# Altium project СlosedLoop_Drive_PCB.PrjPcb
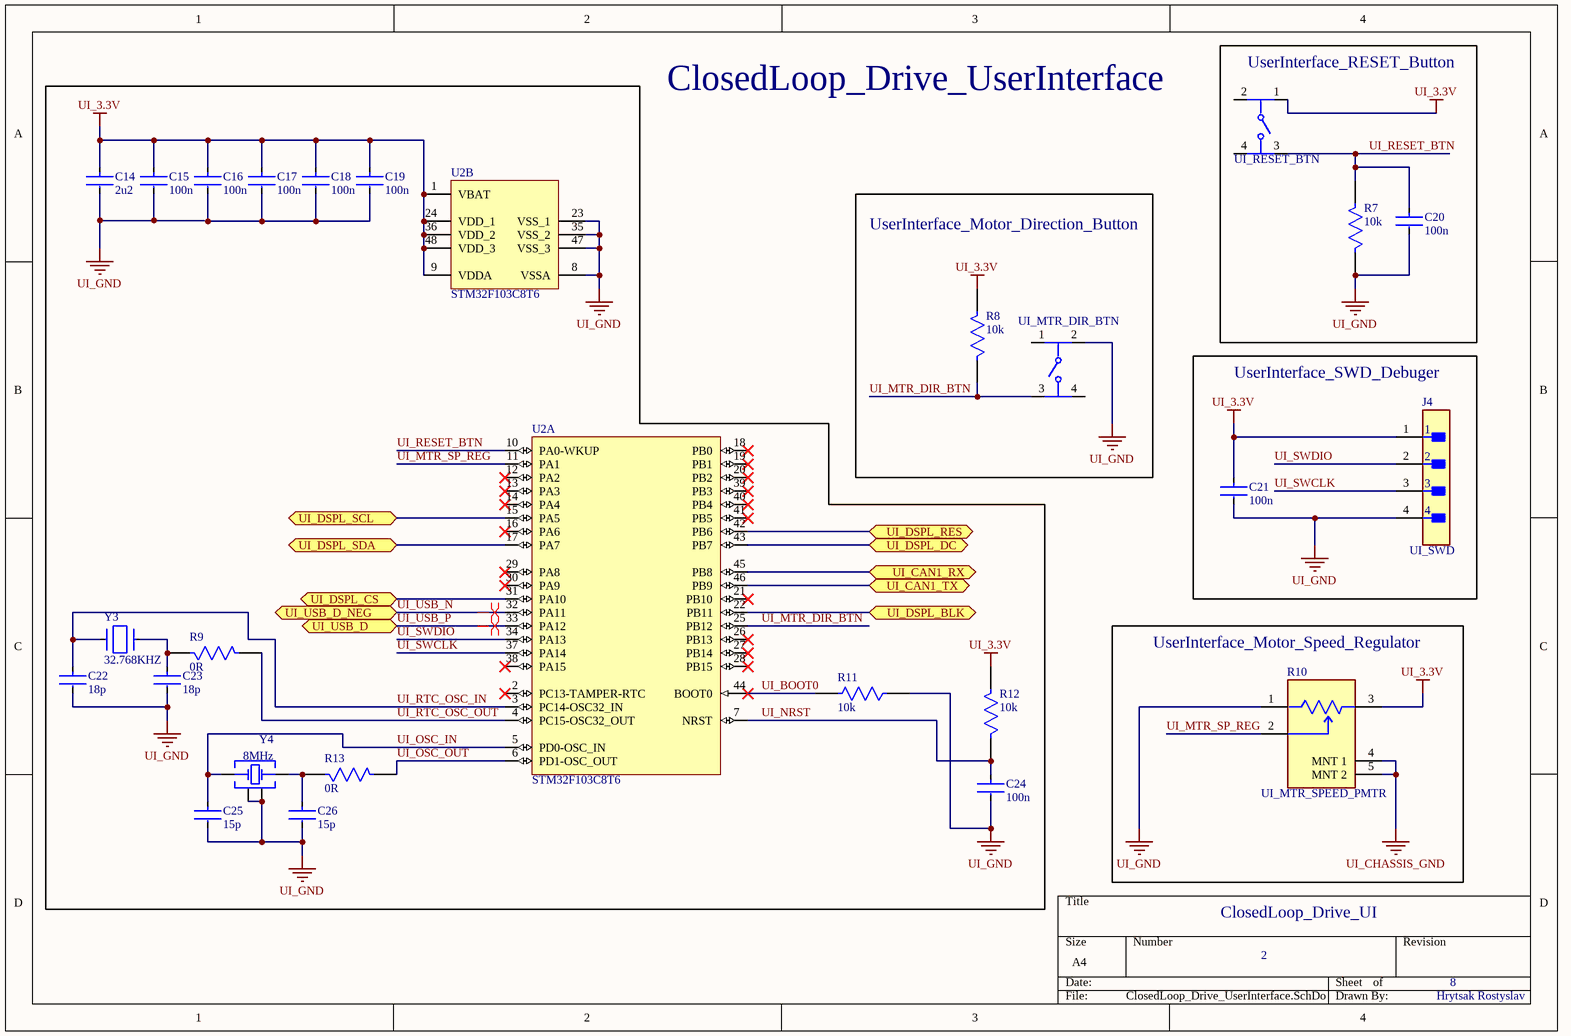
[diagram p0: ClosedLoop_Drive_UserInterface.SchDoc]
7 sheets, 135 parts. Net scope: flat (ports and power ports of the same name join across sheets).
Board file: ClosedLoop_Drive.PcbDoc
Sheets:
  ClosedLoop_Drive_UserInterface.SchDoc
  ClosedLoop_Drive_PowerSupply.SchDoc
  ClosedLoop_Drive_MC_Sensors.SchDoc
  ClosedLoop_Drive_MC_MicroSD_Card.SchDoc
  ClosedLoop_Drive_MC_IBT_2.SchDoc
  ClosedLoop_Drive_CAN_Transceivers.SchDoc
  ClosedLoop_Drive_UI_Display.SchDoc

## Sheet ClosedLoop_Drive_UserInterface.SchDoc
size A4; SheetNumber: 2; SheetTotal: 8

### Parts
C14  2u2  [FP-0805-L_2_01_0_2-W_1_25-MFG]
C15  100n  [FP-0805-L_2_01_0_2-W_1_25-MFG]
C16  100n  [FP-0805-L_2_01_0_2-W_1_25-MFG]
C17  100n  [FP-0805-L_2_01_0_2-W_1_25-MFG]
C18  100n  [FP-0805-L_2_01_0_2-W_1_25-MFG]
C19  100n  [FP-0805-L_2_01_0_2-W_1_25-MFG]
C20  100n  [FP-0805-L_2_01_0_2-W_1_25-MFG]
C21  100n  [FP-0805-L_2_01_0_2-W_1_25-MFG]
C22  18p  [FP-0805-L_2_01_0_2-W_1_25-MFG]
C23  18p  [FP-0805-L_2_01_0_2-W_1_25-MFG]
C24  100n  [FP-0805-L_2_01_0_2-W_1_25-MFG]
C25  15p  [FP-0805-L_2_01_0_2-W_1_25-MFG]
C26  15p  [FP-0805-L_2_01_0_2-W_1_25-MFG]
J4  UI_SWD  [FP-TSW-104-22-G-S-MFG]
R7  10k  [FP-MCU0805-IPC_A]
R8  10k  [FP-MCU0805-IPC_A]
R9  0R  [FP-MCU0805-IPC_A]
R10  UI_MTR_SPEED_PMTR  [FP-PTV09A-4-MFG]
R11  10k  [FP-MCU0805-IPC_A]
R12  10k  [FP-MCU0805-IPC_A]
R13  0R  [FP-MCU0805-IPC_A]
U2  STM32F103C8T6  [STM-LQFP48_L]  (parts A,B of 2)
UI_MTR_DIR_BTN  (no value)  [FP-1-1977223-9-MFG]
UI_RESET_BTN  (no value)  [FP-1-1977223-9-MFG]
Y3  32.768KHZ  [FP-NX2012SA-MFG]
Y4  8MHz  [WE-XTAL_12SMX]

### Blocks framed on the sheet
UserInterface_RESET_Button: C20 R7 UI_RESET_BTN
UserInterface_Motor_Direction_Button: R8 UI_MTR_DIR_BTN
UserInterface_SWD_Debuger: C21 J4
UserInterface_Motor_Speed_Regulator: R10

### Ports
UI_CAN1_RX (bidir, see ClosedLoop_Drive_CAN_Transceivers[1D]), UI_CAN1_TX (bidir, see ClosedLoop_Drive_CAN_Transceivers[1D]), UI_DSPL_BLK (bidir, see ClosedLoop_Drive_UI_Display[3B]), UI_DSPL_CS (bidir, see ClosedLoop_Drive_UI_Display[3C]), UI_DSPL_DC (bidir, see ClosedLoop_Drive_UI_Display[3B]), UI_DSPL_RES (bidir, see ClosedLoop_Drive_UI_Display[3B]), UI_DSPL_SCL (bidir, see ClosedLoop_Drive_UI_Display[3B]), UI_DSPL_SDA (bidir, see ClosedLoop_Drive_UI_Display[3B]), UI_USB_D (bidir, see ClosedLoop_Drive_PowerSupply[3B]), UI_USB_D_NEG (bidir, see ClosedLoop_Drive_PowerSupply[2B])

### Nets
UI_3.3V: C14.1 C15.1 C16.1 C17.1 C18.1 C19.1 C21.1 J4.1 R8.2 R10.3 R12.2 U2.1(VBAT) U2.9(VDDA) U2.24(VDD_1) U2.36(VDD_2) U2.48(VDD_3) UI_RESET_BTN.1
UI_CHASSIS_GND: R10.4(MNT_1) R10.5(MNT_2)
UI_GND: C14.2 C15.2 C16.2 C17.2 C18.2 C19.2 C20.2 C21.2 C22.2 C23.2 C24.2 C25.2 C26.2 J4.4 R7.1 R10.1 R11.1 U2.8(VSSA) U2.23(VSS_1) U2.35(VSS_2) U2.47(VSS_3) UI_MTR_DIR_BTN.2 Y4.2(GND) Y4.4(GND)
UI_BOOT0: R11.2 U2.44(BOOT0)
UI_MTR_DIR_BTN: R8.1 U2.25(PB12) UI_MTR_DIR_BTN.3
UI_MTR_SP_REG: R10.2 U2.11(PA1)
UI_NRST: C24.1 R12.1 U2.7(NRST)
UI_OSC_IN: C25.1 U2.5(PD0-OSC_IN) Y4.3(Crystal)
UI_OSC_OUT: R13.2 U2.6(PD1-OSC_OUT)
UI_RESET_BTN: C20.1 R7.2 U2.10(PA0-WKUP) UI_RESET_BTN.3
UI_RTC_OSC_IN: C22.1 U2.3(PC14-OSC32_IN) Y3.2
UI_RTC_OSC_OUT: R9.2 U2.4(PC15-OSC32_OUT)
UI_SWCLK: J4.3 U2.37(PA14)
UI_SWDIO: J4.2 U2.34(PA13)
UI_USB_N: U2.32(PA11) ; port UI_USB_D_NEG
UI_USB_P: U2.33(PA12) ; port UI_USB_D
NetC23_1: C23.1 R9.1 Y3.1
NetC26_1: C26.1 R13.1 Y4.1(Crystal)
NetJ12_6: U2.42(PB6) ; port UI_DSPL_RES
NetJ12_7: U2.43(PB7) ; port UI_DSPL_DC
NetJ12_8: U2.17(PA7) ; port UI_DSPL_SDA
NetJ12_9: U2.15(PA5) ; port UI_DSPL_SCL
NetJ12_12: U2.31(PA10) ; port UI_DSPL_CS
NetR54_1: U2.22(PB11) ; port UI_DSPL_BLK
NetU2_45: U2.45(PB8) ; port UI_CAN1_RX
NetU2_46: U2.46(PB9) ; port UI_CAN1_TX

Not connected (* = marked no-connect by the designer): U2 2(PC13-TAMPER-RTC)* 12(PA2)* 13(PA3)* 14(PA4)* 16(PA6)* 18(PB0)* 19(PB1)* 20(PB2)* 21(PB10)* 26(PB13)* 27(PB14)* 28(PB15)* 29(PA8)* 30(PA9)* 38(PA15)* 39(PB3)* 40(PB4)* 41(PB5)*; UI_MTR_DIR_BTN 1 4; UI_RESET_BTN 2 4

### Layout directives
differential pair: UI_USB_N, UI_USB_P

### Notes on the sheet
- (near UI_RESET_BTN) ClosedLoop_Drive_UserInterface
- ClosedLoop_Drive_UI
- 2
- 8
- Hrytsak Rostyslav

### Library data of the parts
C14-C26 = CMP-07738-122049624-1: 0805; Tolerance: 10%; Dielectric: X7R; Material: Ceramic; Voltage Rating (DC): 100V; Capacitance: 1µF; Case/Package: 0805; Height: 1.4mm; Voltage Rating: 100V; Schedule B: 8532240020; NexarPartId: 122049624; RoHS: Compliant; Lifecycle Status: Production; Min Operating Temperature: -55°C; Max Operating Temperature: 125°C
J4 = CMP-02766-001236-1: CONN HEADER VERT 4POS 2.54MM; Number of Contacts: 4; Gender: Male; Termination: Solder; Pitch: 2.54mm; Mount: Through Hole; Number of Rows: 1; Packaging: Bulk; Contact Material: Bronze; Contact Plating: Gold; REACH SVHC: No SVHC; Radiation Hardening: No
R7-R9 R11-R13 = CMP-02407-001153-1: 0805; Power Rating: 200mW; Temperature Coefficient: 25ppm/°C; Voltage Rating: 150V; Resistance: 4.99kR; Tolerance: 0.5%; Case Code (Imperial): 0805; Features: Automotive AEC-Q200; Case Code (Metric): 2012; Weight: 0.000162oz; Width: 0.049inch; Packaging: Tape and Reel; Composition: Thin Film; Height: 0.024inch; Termination: SMD/SMT; Number of Terminations: 2; Min Operating Temperature: -55°C; Length: 0.079inch; Package Quantity: 5000; Max Operating Temperature: 175°C; Case/Package: 0805; Max Power Dissipation: 200mW
R10 = CMP-07234-000052-1: POT 10K OHM 1/20W CARBON LINEAR; Power Rating: 50mW; Number of Gangs: 1; Hole Diameter: 9.1mm; Actuator Diameter: 0.236inch; Resistance Tolerance: 20%; Resistance: 10kR; Actuator Length: 0.984inch; Min Operating Temperature: -10°C; RoHS Compliant: Yes; Technology: CARBON FILM; Radiation Hardening: No; Taper: Linear; Military Standard: Not; Type: Potentiometer; Mount: Through Hole; Length: 11.4mm; Tolerance: 20%; Max Power Dissipation: 50mW; Max Operating Temperature: 50°C; Package Quantity: 100; Termination: PCB; Packaging: Bulk; Depth: 12.5mm; Resistor Type: Carbon; Number of Turns: 1; Series: Pro Audio PTV09; Height: 12.5mm; REACH SVHC: No SVHC
U2 = CMP-0237-00215-3: ARM Cortex-M3 32-bit MCU, 64 KB Flash, 20 KB Internal RAM, 37 I/Os, 48-pin LQFP, -40 to 85 degC, Tray; Supply Voltage(Vcc) min (V): 2; Internal RAM Size (kB): 20; FLASH Size (Prog) (kB): 64; A/D Converter: 2x12-bit (10 Channel); I/Os (High Current): 37; Operating Frequency(F) (Processor speed) (MHz): 72; Core: ARM Cortex-M3; ComponentLink3Description: Package Specification; Mounting Technology: Surface Mount; PartNumber: STM32F103C8T6; PackageReference: LQFP48; Packing: Tray; ComponentLink3URL: http://www.st.com/st-web-ui/static/active/en/resource/technical/document/datasheet/DM00058181.pdf; DatasheetVersion: Rev. 16; ComponentLink1URL: http://www.st.com/web/en/home.html; PackageVersion: Rev. 6, 06/2013; ComponentLink2URL: http://www.st.com/st-web-ui/static/active/en/resource/technical/document/datasheet/CD00161566.pdf; ComponentLink1Description: Manufacturer URL; ComponentLink2Description: Datasheet; PackageDescription: 48-Pin Low Profile Quad Flat Package, 7 x 7 mm Body, 0.5 mm Pitch
UI_MTR_DIR_BTN UI_RESET_BTN = CMP-03407-000015-1: SWITCH TACTILE SPST-NO 0.05A 24V; Current Rating: 50mA; Operating Force: 2.55N; Throw Configuration: SPST; Actuator Material: Nylon; Actuator Color: Pink; Mechanical Life: 1000000Cycles; Illumination Type: Non-Illuminated; Switch Travel: 0.25mm; Switch Function: Off-Mom; Actuator Type: Standard; RoHS Compliant: Yes; Min Operating Temperature: -40°C; Contact Plating: Silver; Max Operating Temperature: 105°C; Contact Material: Stainless Steel; Max Current Rating: 50mA; Series: FSMJSMA; Length: 6mm; Radiation Hardening: No; Depth: 10mm; Max Voltage Rating (DC): 24V; Orientation: Straight; Termination: Gull Wing; Voltage Rating (DC): 24V; Packaging: Bulk; Mount: Surface Mount; Case/Package: SMD/SMT; Package Quantity: 750
Y3 = CMP-200220-000019-1: CRYSTAL 32.7680KHZ 12.5PF SMD; Frequency Tolerance: 20ppm; ESR (Equivalent Series Resistance): 80kR; Mount: Surface Mount; Packaging: Cut Tape; Min Operating Temperature: -40°C; Max Operating Temperature: 85°C; Case/Package: SMD/SMT; Frequency: 32.768kHz; RoHS Compliant: Yes; Length: 0.081inch; Series: NX2012SA; Height: 0.024inch; Width: 0.047inch; Load Capacitance: 12.5pF
Y4 = CMP-03913-116855696-2: WE-XTAL Quartz Crystal; Frequency: 8MHz; Max Operating Temperature: 70°C; Height: 1.4mm; Min Operating Temperature: -20°C; Length: 7mm; Width: 5mm

## Sheet ClosedLoop_Drive_PowerSupply.SchDoc
size A4; SheetNumber: 3; SheetTotal: 8
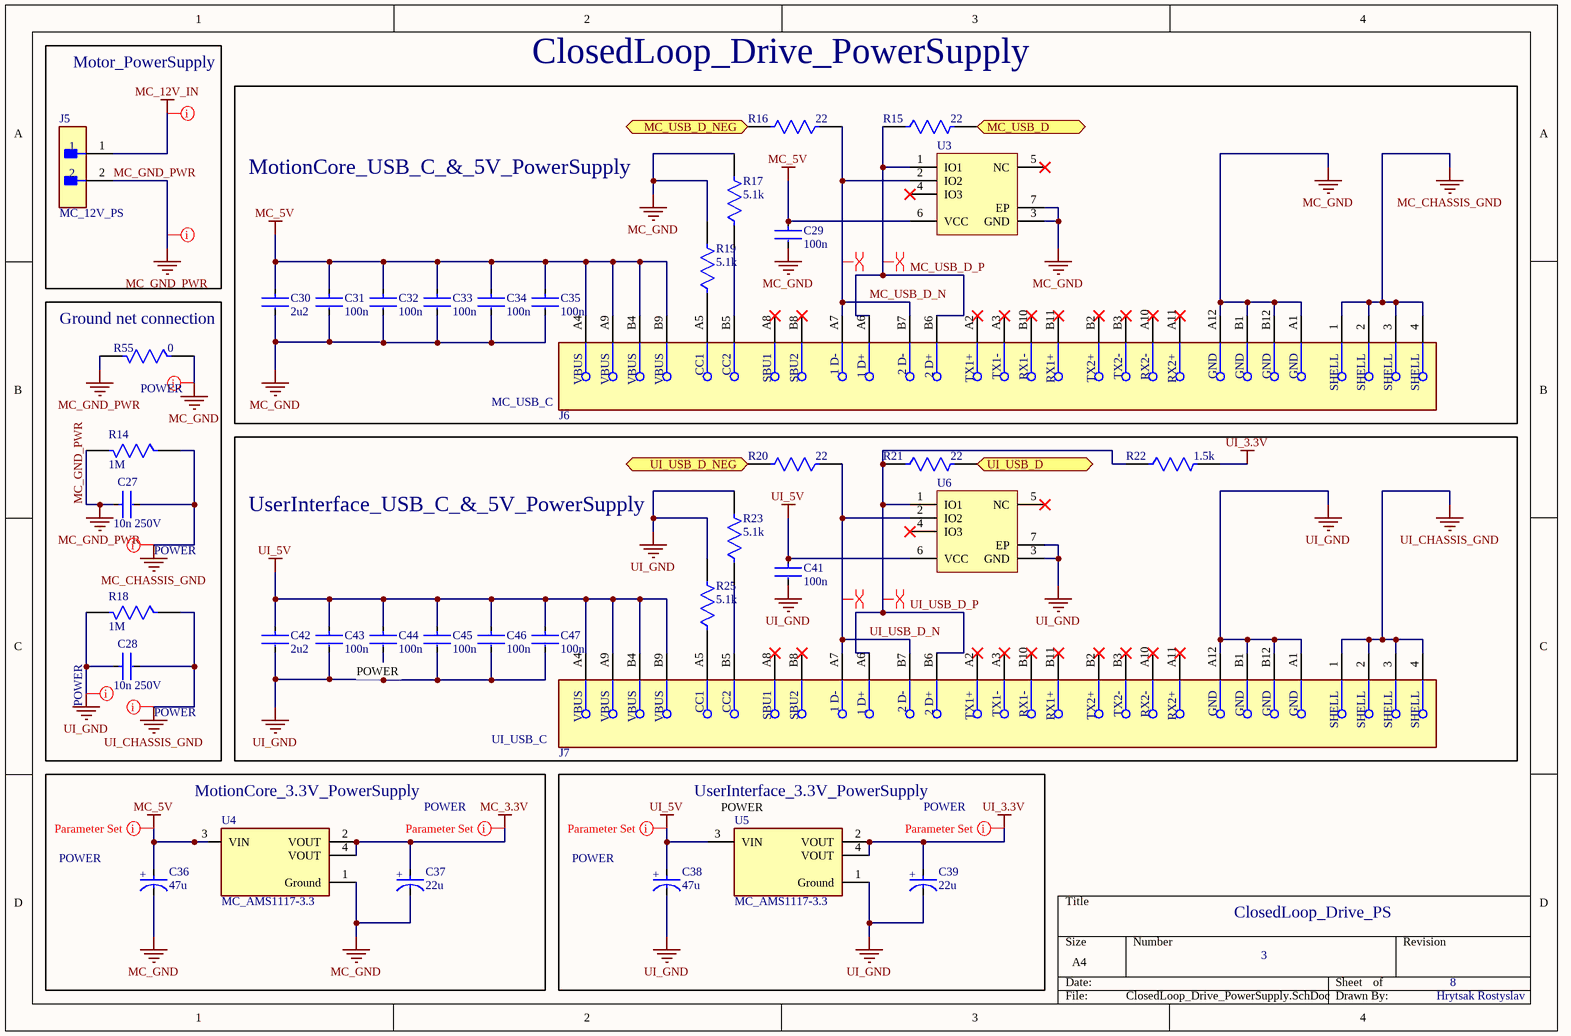
[diagram p1: ClosedLoop_Drive_PowerSupply.SchDoc]

### Parts
C27  10n 250V  [FP-0805-L_2_01_0_2-W_1_25-MFG]
C28  10n 250V  [FP-0805-L_2_01_0_2-W_1_25-MFG]
C29  100n  [FP-0805-L_2_01_0_2-W_1_25-MFG]
C30  2u2  [FP-0805-L_2_01_0_2-W_1_25-MFG]
C31  100n  [FP-0805-L_2_01_0_2-W_1_25-MFG]
C32  100n  [FP-0805-L_2_01_0_2-W_1_25-MFG]
C33  100n  [FP-0805-L_2_01_0_2-W_1_25-MFG]
C34  100n  [FP-0805-L_2_01_0_2-W_1_25-MFG]
C35  100n  [FP-0805-L_2_01_0_2-W_1_25-MFG]
C36  47u  [FP-RAD-TH-D_6_3_0_5-L_11-MFG]
C37  22u  [FP-RAD-TH-D_6_3_0_5-L_11-MFG]
C38  47u  [FP-RAD-TH-D_6_3_0_5-L_11-MFG]
C39  22u  [FP-RAD-TH-D_6_3_0_5-L_11-MFG]
C41  100n  [FP-0805-L_2_01_0_2-W_1_25-MFG]
C42  2u2  [FP-0805-L_2_01_0_2-W_1_25-MFG]
C43  100n  [FP-0805-L_2_01_0_2-W_1_25-MFG]
C44  100n  [FP-0805-L_2_01_0_2-W_1_25-MFG]
C45  100n  [FP-0805-L_2_01_0_2-W_1_25-MFG]
C46  100n  [FP-0805-L_2_01_0_2-W_1_25-MFG]
C47  100n  [FP-0805-L_2_01_0_2-W_1_25-MFG]
J5  MC_12V_PS  [FP-TSW-102-07-F-S-MFG]
J6  MC_USB_C  [FP-12401832E402A-MFG]
J7  UI_USB_C  [FP-12401832E402A-MFG]
R14  1M  [FP-MCU0805-IPC_A]
R15  22  [FP-MCU0805-IPC_A]
R16  22  [FP-MCU0805-IPC_A]
R17  5.1k  [FP-MCU0805-IPC_A]
R18  1M  [FP-MCU0805-IPC_A]
R19  5.1k  [FP-MCU0805-IPC_A]
R20  22  [FP-MCU0805-IPC_A]
R21  22  [FP-MCU0805-IPC_A]
R22  1.5k  [FP-MCU0805-IPC_A]
R23  5.1k  [FP-MCU0805-IPC_A]
R25  5.1k  [FP-MCU0805-IPC_A]
R55  0  [FP-MCU0805-IPC_A]
U3  (no value)  [DRS0006A_V]
U4  MC_AMS1117-3.3  [FP-AMS1117-IPC_C]
U5  MC_AMS1117-3.3  [FP-AMS1117-IPC_C]
U6  (no value)  [DRS0006A_V]

### Blocks framed on the sheet
Motor_PowerSupply: J5
ClosedLoop_Drive_PowerSupply: C29-C35 J6 R15-R17 R19 U3
Ground net connection: C27 C28 R14 R18 R55
UserInterface_USB_C_&_5V_PowerSupply: C41-C47 J7 R20-R23 R25 U6
MotionCore_3.3V_PowerSupply: C36 C37 U4
UserInterface_3.3V_PowerSupply: C38 C39 U5

### Ports
MC_USB_D (bidir, see ClosedLoop_Drive_MotionCore[1C]), MC_USB_D_NEG (bidir, see ClosedLoop_Drive_MotionCore[1C]), UI_USB_D (bidir, see ClosedLoop_Drive_UserInterface[1C]), UI_USB_D_NEG (bidir, see ClosedLoop_Drive_UserInterface[1C])

### Nets
MC_3.3V: C37.2(A) U4.2(VOUT) U4.4(VOUT)
MC_5V: C29.1 C30.1 C31.1 C32.1 C33.1 C34.1 C35.1 C36.2(A) J6.A4(VBUS) J6.A9(VBUS) J6.B4(VBUS) J6.B9(VBUS) U3.6(VCC) U4.3(VIN)
MC_12V_IN: J5.1
MC_CHASSIS_GND: C27.2 J6.1(SHELL) J6.2(SHELL) J6.3(SHELL) J6.4(SHELL) R14.1
MC_GND: C29.2 C30.2 C31.2 C32.2 C33.2 C34.2 C35.2 C36.1(C) C37.1(C) J6.A1(GND) J6.A12(GND) J6.B1(GND) J6.B12(GND) R17.2 R19.2 R55.1 U3.3(GND) U3.7(EP) U4.1(Ground)
MC_GND_PWR: C27.1 J5.2 R14.2 R55.2
UI_3.3V: C39.2(A) R22.2 U5.2(VOUT) U5.4(VOUT)
UI_5V: C38.2(A) C41.1 C42.1 C43.1 C44.1 C45.1 C46.1 C47.1 J7.A4(VBUS) J7.A9(VBUS) J7.B4(VBUS) J7.B9(VBUS) U5.3(VIN) U6.6(VCC)
UI_CHASSIS_GND: C28.2 J7.1(SHELL) J7.2(SHELL) J7.3(SHELL) J7.4(SHELL) R18.1
UI_GND: C28.1 C38.1(C) C39.1(C) C41.2 C42.2 C43.2 C44.2 C45.2 C46.2 C47.2 J7.A1(GND) J7.A12(GND) J7.B1(GND) J7.B12(GND) R18.2 R23.2 R25.2 U5.1(Ground) U6.3(GND) U6.7(EP)
MC_USB_D_N: J6.A7(1_D-) J6.B7(2_D-) R16.1 U3.2(IO2)
MC_USB_D_P: J6.A6(1_D+) J6.B6(2_D+) R15.1 U3.1(IO1)
UI_USB_D_N: J7.A7(1_D-) J7.B7(2_D-) R20.1 U6.2(IO2)
UI_USB_D_P: J7.A6(1_D+) J7.B6(2_D+) R21.1 R22.1 U6.1(IO1)
UI_USB_N: R20.2 ; port UI_USB_D_NEG
UI_USB_P: R21.2 ; port UI_USB_D
NetJ6_A5: J6.A5(CC1) R19.1
NetJ6_B5: J6.B5(CC2) R17.1
NetJ7_A5: J7.A5(CC1) R25.1
NetJ7_B5: J7.B5(CC2) R23.1
NetR15_2: R15.2 ; port MC_USB_D
NetR16_2: R16.2 ; port MC_USB_D_NEG

Not connected (* = marked no-connect by the designer): J6 A2(TX1+)* A3(TX1-)* A8(SBU1)* A10(RX2-)* A11(RX2+)* B2(TX2+)* B3(TX2-)* B8(SBU2)* B10(RX1-)* B11(RX1+)*; J7 A2(TX1+)* A3(TX1-)* A8(SBU1)* A10(RX2-)* A11(RX2+)* B2(TX2+)* B3(TX2-)* B8(SBU2)* B10(RX1-)* B11(RX1+)*; U3 4(IO3)* 5(NC)*; U6 4(IO3)* 5(NC)*

### Layout directives
CompClassName: POWER; net class POWER: MC_3.3V, MC_5V, UI_3.3V, UI_5V
differential pair: MC_USB_D_N, MC_USB_D_P, UI_USB_D_N, UI_USB_D_P
rule Supply Nets [Voltage = 0.000]; net class POWER: MC_12V_IN, MC_GND_PWR
CompClassName: POWER; rule Supply Nets [Voltage = 0.000]; net class POWER: MC_CHASSIS_GND, MC_GND, UI_CHASSIS_GND, UI_GND

### Notes on the sheet
- MotionCore_USB_C_&_5V_PowerSupply
- (near C44) POWER
- (near U5) POWER
- ClosedLoop_Drive_PS
- 3
- 8
- Hrytsak Rostyslav
- (in symbol CMP-05427-000141-1) +

### Library data of the parts
C27-C35 C41-C47 = CMP-07738-122049624-1: as C14 on sheet ClosedLoop_Drive_UserInterface; Case/Package: 0805; Height: 1.4mm; Voltage Rating: 100V; Schedule B: 8532240020; NexarPartId: 122049624; RoHS: Compliant; Lifecycle Status: Production; Min Operating Temperature: -55°C; Max Operating Temperature: 125°C
C36-C39 = CMP-05427-000141-1: Aluminum Electrolytic Capacitors (Radial Lead Type) AEC-Q200 Qualified 100uF ±20% 25V; Lead Diameter: 0.5mm; Life (Hours): 1000Hour; Ripple Current: 130mA; Lead/Base Style: Straight; Construction: RADIAL; Radiation Hardening: No; Packaging: Ammo Pack; Termination: Radial; Mount: Through Hole; Lead Pitch: 2.5mm; Tolerance: 20%; Height - Seated (Max): 0.48inch; Height: 11.2mm; Max Operating Temperature: 105°C; Length: 11.2mm; Diameter: 6.3mm; RoHS Compliant: Yes; Voltage Rating: 25V; Min Operating Temperature: -55°C; Package Quantity: 2000; Capacitance: 100uF; Width: 6.3mm; Voltage Rating (DC): 25V; Series: NHG; Contact Plating: Tin; Case/Package: Radial
J5 = CMP-02766-001458-1: CONN HEADER VERT 2POS 2.54MM; Gender: Male; Max Current Rating: 7.6A; Number of Contacts: 2; Max Voltage Rating (AC): 550V; Orientation: Straight; Depth: 2.54mm; Series: TSW; Package Quantity: 1; Min Operating Temperature: -55°C; Max Operating Temperature: 125°C; Contact Type: Male Pin; Contact Shape: Square; Color: Black; Housing Color: Black; Connector Type: Header; Fastening Type: Pull; Radiation Hardening: No; Pitch: 2.54mm; Housing Material: Polyester; Mount: Through Hole; Number of Positions: 2; Number of Rows: 1; Contact Material: Bronze; Insulation Color: Black; Contact Finish - Mating: GOLD; Termination: Solder; Insulation Material: PBT; Length: 5.08mm; Flammability Rating: UL94 V-0; Contact Mating Length: 0.23inch; REACH SVHC: No SVHC; Contact Plating: Gold; RoHS Compliant: Yes; Packaging: Bulk
J6 J7 = CMP-02355-000004-1: CONN RCP USB3.1 TYPEC 24P SMD RA
R14-R23 R25 R55 = CMP-02407-001153-1: as R7 on sheet ClosedLoop_Drive_UserInterface; Case Code (Imperial): 0805; Features: Automotive AEC-Q200; Case Code (Metric): 2012; Weight: 0.000162oz; Width: 0.049inch; Packaging: Tape and Reel; Composition: Thin Film; Height: 0.024inch; Termination: SMD/SMT; Number of Terminations: 2; Min Operating Temperature: -55°C; Length: 0.079inch; Package Quantity: 5000; Max Operating Temperature: 175°C; Case/Package: 0805; Max Power Dissipation: 200mW
U3 U6 = CMP-0326-00043-3: Low-Capacitance + / - 15 kV ESD-Protection Array for High-Speed Data Interfaces, 3 Channels, -40 to +85 degC, 6-pin SON (DRS), Green (RoHS & no Sb/Br); Manufacturer: Texas Instruments; PartNumber: TPD3E001DRSR; Breakdown Voltage(Min)(V): 11; USB High Speed: TRUE; IO Capacitance(Typ)(pF): 1.5; IEC 61000-4-2 Air-Gap(+/- kV): 15; IEC 61000-4-2 Contact(+/- kV): 8; IO Leakage Current(nA): 1; SubFamily: ESD Solution; ComponentLink1URL: http://www.ti.com/; PackageVersion: revF, Jul-2011; ComponentLink2Description: Datasheet; PackageDescription: 6-Pin Plastic Small Outline No-Lead, 3 x 3 x 0.8 mm Body, 0.95 mm Pitch; Mounting Technology: Surface Mount; DatasheetVersion: SLLS683D; ComponentLink3URL: SamplesURL:http://www.ti.com/product/tpd3e001#samples; ComponentLink2URL: http://www.ti.com/general/docs/lit/getliterature.tsp?genericPartNumber=TPD3E001&fileType=pdf; ComponentLink1Description: Manufacturer URL; ComponentLink3Description: URL Link1; PackageReference: DRS0006A; Eco-Plan: Green (RoHS & no Sb/Br)
U4 U5 = CMP-209535-000001-1: LDO Voltage Regulators 1A, 3.3V; Manufacturer: Advanced Monolithic Systems; Dropout Voltage: 1.1V; Output Type: Fixed; Nominal Supply Current: 5mA; Max Power Dissipation: 1.2W; Max Supply Voltage: 15V; Number Of Outputs: 1; Standoff Height: 0.64mm; Max Junction Temp: +125°C; Height: 1.8mm; Package: AMS1117; Device Class L2: Power Management ICs; ComponentLink2Description: Datasheet; ComponentLink2URL: http://www.advanced-monolithic.com/pdf/ds1117.pdf; Category: IC; RoHS: TRUE; Automotive: No; Device Class L1: Integrated Circuits (ICs); Output Current: 1A; Device Class L3: Voltage Regulators - Linear; Temperature: -40°C to +125°C; Output Voltage: 3.3V; Manufacturer Part Number: AMS1117-3.3; Temperature Range Low: -40°C; Octopart: https://octopart.com/ams1117-3.3-advanced+monolithic+systems-25899300; Lead Free: Yes; Ipc Land Pattern Name: SOT229P700X180-4; Temperature Range High: +125°C

## Sheet ClosedLoop_Drive_MC_Sensors.SchDoc
size A4; SheetNumber: 4; SheetTotal: 8
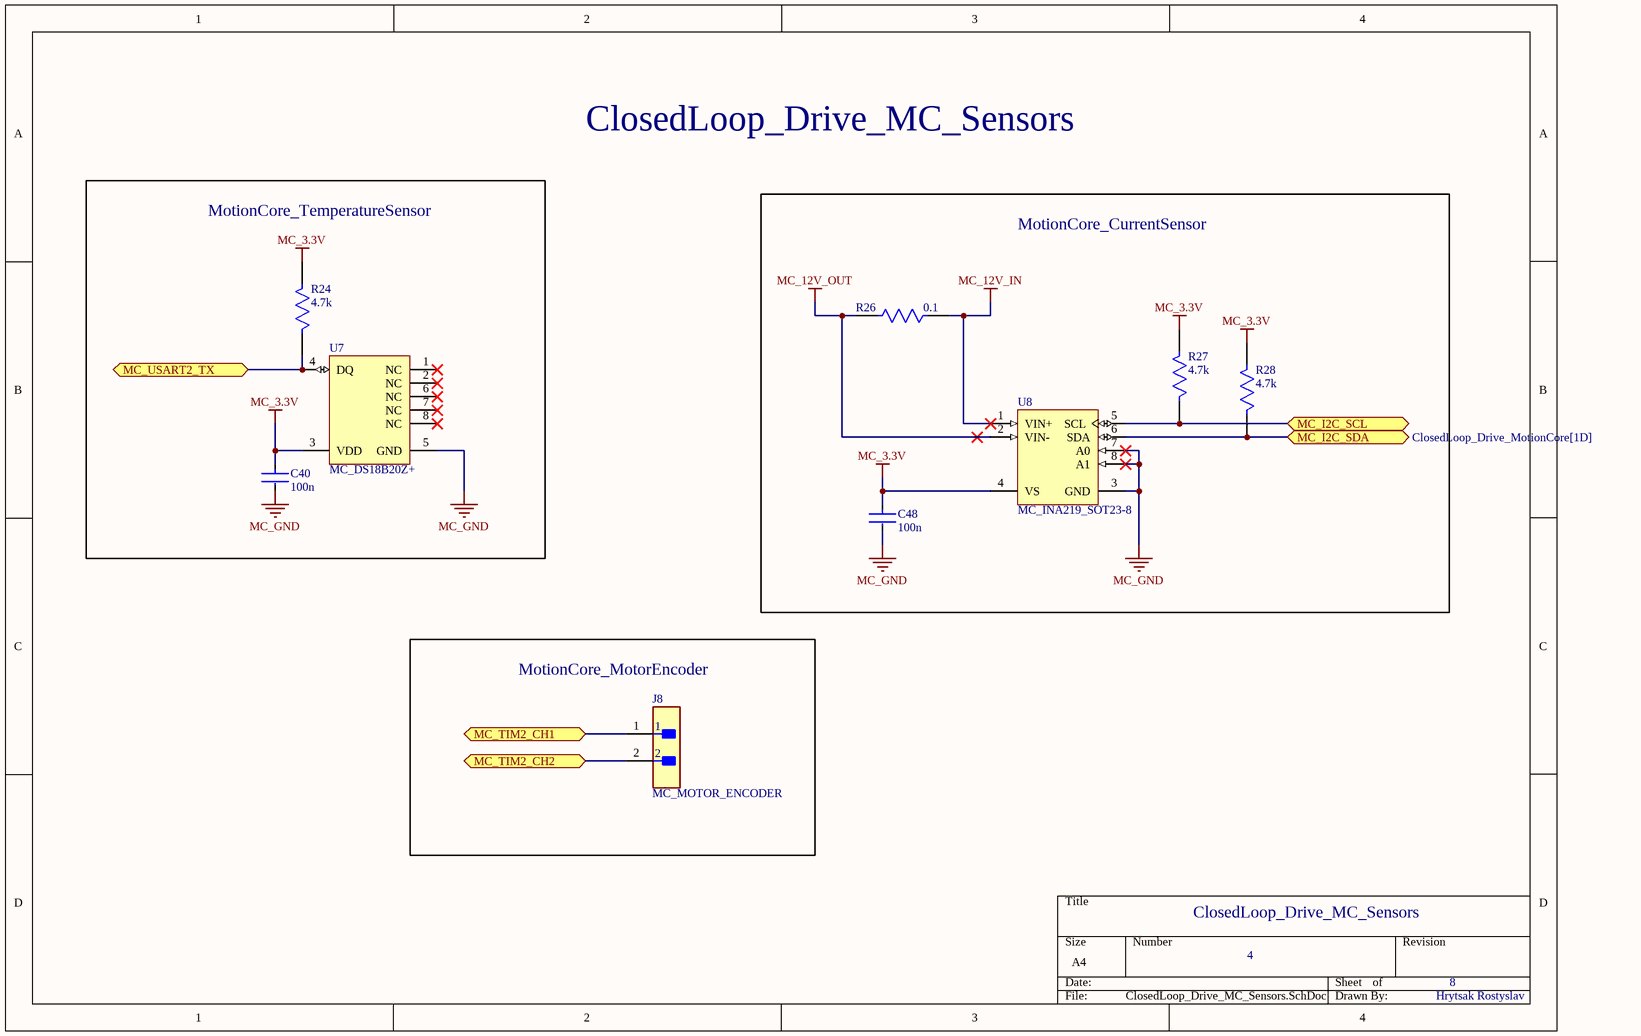
[diagram p2: ClosedLoop_Drive_MC_Sensors.SchDoc]

### Parts
C40  100n  [FP-0805-L_2_01_0_2-W_1_25-MFG]
C48  100n  [FP-0805-L_2_01_0_2-W_1_25-MFG]
J8  MC_MOTOR_ENCODER  [FP-TSW-102-07-F-S-MFG]
R24  4.7k  [FP-MCU0805-IPC_A]
R26  0.1  [FP-CRA2512-IPC_C]
R27  4.7k  [FP-MCU0805-IPC_A]
R28  4.7k  [FP-MCU0805-IPC_A]
U7  MC_DS18B20Z+  [MAXM-S8+2_L]
U8  MC_INA219_SOT23-8  [DCN0008A_L]

### Blocks framed on the sheet
MotionCore_TemperatureSensor: C40 R24 U7
MotionCore_CurrentSensor: C48 R26-R28 U8
MotionCore_MotorEncoder: J8

### Ports
MC_I2C_SCL (bidir, see ClosedLoop_Drive_MotionCore[1D]), MC_I2C_SDA (bidir, see ClosedLoop_Drive_MotionCore[1D]), MC_TIM2_CH1 (bidir, see ClosedLoop_Drive_MotionCore[1C]), MC_TIM2_CH2 (bidir, see ClosedLoop_Drive_MotionCore[1C]), MC_USART2_TX (bidir, see ClosedLoop_Drive_MotionCore[1C])

### Nets
MC_3.3V: C40.1 C48.1 R24.2 R27.2 R28.2 U7.3(VDD) U8.4(VS)
MC_12V_IN: R26.1 U8.1(VIN+)
MC_12V_OUT: R26.2 U8.2(VIN-)
MC_GND: C40.2 C48.2 U7.5(GND) U8.3(GND) U8.7(A0) U8.8(A1)
NetJ8_1: J8.1 ; port MC_TIM2_CH1
NetJ8_2: J8.2 ; port MC_TIM2_CH2
NetR24_1: R24.1 U7.4(DQ) ; port MC_USART2_TX
NetR27_1: R27.1 U8.5(SCL) ; port MC_I2C_SCL
NetR28_1: R28.1 U8.6(SDA) ; port MC_I2C_SDA

Not connected (* = marked no-connect by the designer): U7 1(NC)* 2(NC)* 6(NC)* 7(NC)* 8(NC)*

### Notes on the sheet
- ClosedLoop_Drive_MC_Sensors
- 4
- 8
- Hrytsak Rostyslav

### Library data of the parts
C40 C48 = CMP-07738-122049624-1: as C14 on sheet ClosedLoop_Drive_UserInterface; Case/Package: 0805; Height: 1.4mm; Voltage Rating: 100V; Schedule B: 8532240020; NexarPartId: 122049624; RoHS: Compliant; Lifecycle Status: Production; Min Operating Temperature: -55°C; Max Operating Temperature: 125°C
J8 = CMP-02766-001458-1: as J5 on sheet ClosedLoop_Drive_PowerSupply; Orientation: Straight; Depth: 2.54mm; Series: TSW; Package Quantity: 1; Min Operating Temperature: -55°C; Max Operating Temperature: 125°C; Contact Type: Male Pin; Contact Shape: Square; Color: Black; Housing Color: Black; Connector Type: Header; Fastening Type: Pull; Radiation Hardening: No; Pitch: 2.54mm; Housing Material: Polyester; Mount: Through Hole; Number of Positions: 2; Number of Rows: 1; Contact Material: Bronze; Insulation Color: Black; Contact Finish - Mating: GOLD; Termination: Solder; Insulation Material: PBT; Length: 5.08mm; Flammability Rating: UL94 V-0; Contact Mating Length: 0.23inch; REACH SVHC: No SVHC; Contact Plating: Gold; RoHS Compliant: Yes; Packaging: Bulk
R24 R27 R28 = CMP-02407-001153-1: as R7 on sheet ClosedLoop_Drive_UserInterface; Case Code (Imperial): 0805; Features: Automotive AEC-Q200; Case Code (Metric): 2012; Weight: 0.000162oz; Width: 0.049inch; Packaging: Tape and Reel; Composition: Thin Film; Height: 0.024inch; Termination: SMD/SMT; Number of Terminations: 2; Min Operating Temperature: -55°C; Length: 0.079inch; Package Quantity: 5000; Max Operating Temperature: 175°C; Case/Package: 0805; Max Power Dissipation: 200mW
R26 = CMP-07231-006698-1: RES 0.1 OHM 1% 3W 2512
U7 = CMP-0253-00019-2: High-Precision 1-Wire Digital Thermometer, -55 to 125 degC, 8-Pin SOIC (S8+2), Pb-Free; Sensor Type: Local; Temp. Thresh.: Programmable (NV); Parasite Pwr.: Yes; ComponentLink1Description: Manufacturer URL; PartNumber: DS18B20Z+; Mounting Technology: Surface Mount; ComponentLink2URL: http://datasheets.maximintegrated.com/en/ds/DS18B20.pdf; Code_JEDEC: MS012; ComponentLink2Description: Datasheet; DatasheetVersion: Rev. 4; PackageVersion: Rev. D, 10/2012; ComponentLink1URL: http://www.maximintegrated.com/; PackageReference: S8+2; ComponentLink3URL: http://pdfserv.maximintegrated.com/package_dwgs/21-0041.PDF; Interface: 1-Wire; ComponentLink3Description: Package Specification; RoHS: Pb-Free; Multi Droppable: Yes; Generic Part Number: DS18B20; PackageDescription: 8-Pin Small-Outline IC, Narrow (0.15in) (S8+2), Body 4.90 x 3.90 mm, Pitch 1.27 mm
U8 = CMP-0704-00039-2: Zero-Drift, Bi-Directional Current / Power Monitor, 3 to 5.5 V, -40 to 125 degC, 8-pin SOT23 (DCN8), Green (RoHS & no Sb/Br); Manufacturer: Texas Instruments; PartNumber: INA219AIDCNT; Input Offset (+/-)(Max)(uV): 100; Common Mode Range(Max)(V): 26; Gain(V/V): 1, 0.5, 0.25, 0.125; Vs(Min)(V): 3; Vs(Max)(V): 5.5; Small-Signal Bandwidth(Typ)(MHz): 0.011; Rating: Catalog; SubFamily: Current Shunt Monitor; Common Mode Range(Min)(V): 0; Quiescent Current (+/-)(Typ)(mA): 0.7; Code_JEDEC: MO-178; DatasheetVersion: SBOS448F; ComponentLink3URL: http://www.ti.com/lit/ml/mpds099c/mpds099c.pdf; PackageReference: DCN0008A; Eco-Plan: Green (RoHS & no Sb/Br); PackageVersion: 4202106/D, 11/2009; PackageDescription: 8-Pin Plastic Small Outline, Body 1.6 x 2.9 mm, Pitch 0.65 mm; ComponentLink3Description: Package Specification; ComponentLink1Description: Manufacturer URL; ComponentLink1URL: http://www.ti.com/; CMRR(Min)(dB): 100; Mounting Technology: Surface Mount; ComponentLink2URL: http://www.ti.com/general/docs/lit/getliterature.tsp?genericPartNumber=INA219&fileType=pdf; ComponentLink2Description: Datasheet

## Sheet ClosedLoop_Drive_MC_MicroSD_Card.SchDoc
size A4; SheetNumber: 5; SheetTotal: 8
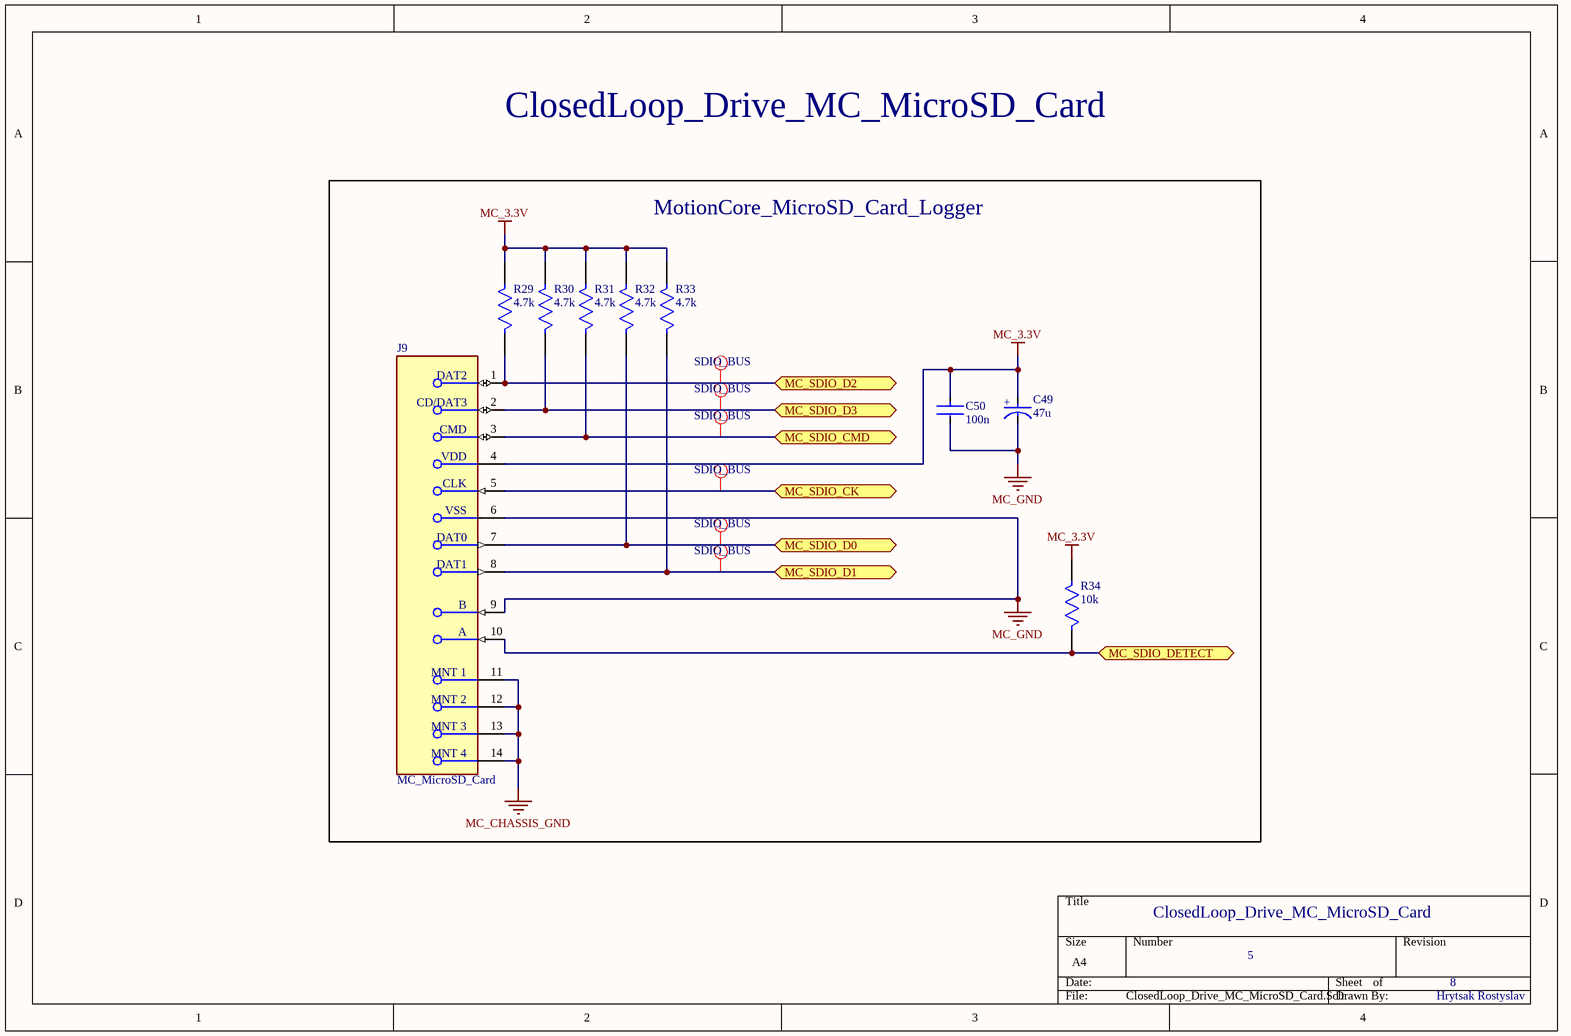
[diagram p3: ClosedLoop_Drive_MC_MicroSD_Card.SchDoc]

### Parts
C49  47u  [FP-RAD-TH-D_6_3_0_5-L_11-MFG]
C50  100n  [FP-0805-L_2_01_0_2-W_1_25-MFG]
J9  MC_MicroSD_Card  [FP-DM3AT-SF-PEJM5_40-MFG]
R29  4.7k  [FP-MCU0805-IPC_A]
R30  4.7k  [FP-MCU0805-IPC_A]
R31  4.7k  [FP-MCU0805-IPC_A]
R32  4.7k  [FP-MCU0805-IPC_A]
R33  4.7k  [FP-MCU0805-IPC_A]
R34  10k  [FP-MCU0805-IPC_A]

### Blocks framed on the sheet
MotionCore_MicroSD_Card_Logger: C49 C50 J9 R29-R34

### Ports
MC_SDIO_CK (bidir, see ClosedLoop_Drive_MotionCore[1D]), MC_SDIO_CMD (bidir, see ClosedLoop_Drive_MotionCore[1C]), MC_SDIO_D0 (bidir, see ClosedLoop_Drive_MotionCore[3C]), MC_SDIO_D1 (bidir, see ClosedLoop_Drive_MotionCore[3C]), MC_SDIO_D2 (bidir, see ClosedLoop_Drive_MotionCore[3C]), MC_SDIO_D3 (bidir, see ClosedLoop_Drive_MotionCore[3C]), MC_SDIO_DETECT (bidir, see ClosedLoop_Drive_MotionCore[1C])

### Nets
MC_3.3V: C49.2(A) C50.1 J9.4(VDD) R29.2 R30.2 R31.2 R32.2 R33.2 R34.2
MC_CHASSIS_GND: J9.11(MNT_1) J9.12(MNT_2) J9.13(MNT_3) J9.14(MNT_4)
MC_GND: C49.1(C) C50.2 J9.6(VSS) J9.9(B)
NetJ9_1: J9.1(DAT2) R29.1 ; port MC_SDIO_D2
NetJ9_2: J9.2(CD/DAT3) R30.1 ; port MC_SDIO_D3
NetJ9_3: J9.3(CMD) R31.1 ; port MC_SDIO_CMD
NetJ9_5: J9.5(CLK) ; port MC_SDIO_CK
NetJ9_7: J9.7(DAT0) R32.1 ; port MC_SDIO_D0
NetJ9_8: J9.8(DAT1) R33.1 ; port MC_SDIO_D1
NetJ9_10: J9.10(A) R34.1 ; port MC_SDIO_DETECT

### Layout directives
net class SDIO_BUS: NetJ9_1, NetJ9_2, NetJ9_3, NetJ9_5, NetJ9_7, NetJ9_8

### Notes on the sheet
- ClosedLoop_Drive_MC_MicroSD_Card
- 5
- 8
- Hrytsak Rostyslav
- (in symbol CMP-05427-000141-1) +

### Library data of the parts
C49 = CMP-05427-000141-1: as C36 on sheet ClosedLoop_Drive_PowerSupply; Construction: RADIAL; Radiation Hardening: No; Packaging: Ammo Pack; Termination: Radial; Mount: Through Hole; Lead Pitch: 2.5mm; Tolerance: 20%; Height - Seated (Max): 0.48inch; Height: 11.2mm; Max Operating Temperature: 105°C; Length: 11.2mm; Diameter: 6.3mm; RoHS Compliant: Yes; Voltage Rating: 25V; Min Operating Temperature: -55°C; Package Quantity: 2000; Capacitance: 100uF; Width: 6.3mm; Voltage Rating (DC): 25V; Series: NHG; Contact Plating: Tin; Case/Package: Radial
C50 = CMP-07738-122049624-1: as C14 on sheet ClosedLoop_Drive_UserInterface; Case/Package: 0805; Height: 1.4mm; Voltage Rating: 100V; Schedule B: 8532240020; NexarPartId: 122049624; RoHS: Compliant; Lifecycle Status: Production; Min Operating Temperature: -55°C; Max Operating Temperature: 125°C
J9 = CMP-11597-000006-1: CONN MICRO SD R/A PUSH-PUSH SMD; Contact Resistance: 100mR; Insulation Resistance: 1GR; Gender: Receptacle; Max Voltage Rating (AC): 125V; Pitch: 1.1mm; Mating Cycles: 10000; Max Current Rating: 500mA; Connector Type: Connector; Number of Contacts: 8; Housing Material: Polymer; Flammability Rating: UL94 V-0; REACH SVHC: No SVHC; Lead Free: Lead Free; Package Quantity: 400; Length: 13.85mm; Number of Rows: 2; Series: DM3; Min Operating Temperature: -25°C; Voltage Rating (AC): 125V; Contact Material: Copper Alloy; Depth: 15.95mm; Contact Plating: Gold; Packaging: Tape and Reel; Width: 13.85mm; Orientation: Right Angle; Color: Black; Voltage Rating: 125V; Radiation Hardening: No; Termination: Solder; Current Rating: 500mA; Mount: Surface Mount; Max Operating Temperature: 85°C
R29-R34 = CMP-02407-001153-1: as R7 on sheet ClosedLoop_Drive_UserInterface; Case Code (Imperial): 0805; Features: Automotive AEC-Q200; Case Code (Metric): 2012; Weight: 0.000162oz; Width: 0.049inch; Packaging: Tape and Reel; Composition: Thin Film; Height: 0.024inch; Termination: SMD/SMT; Number of Terminations: 2; Min Operating Temperature: -55°C; Length: 0.079inch; Package Quantity: 5000; Max Operating Temperature: 175°C; Case/Package: 0805; Max Power Dissipation: 200mW

## Sheet ClosedLoop_Drive_MC_IBT_2.SchDoc
size A4; SheetNumber: 6; SheetTotal: 8
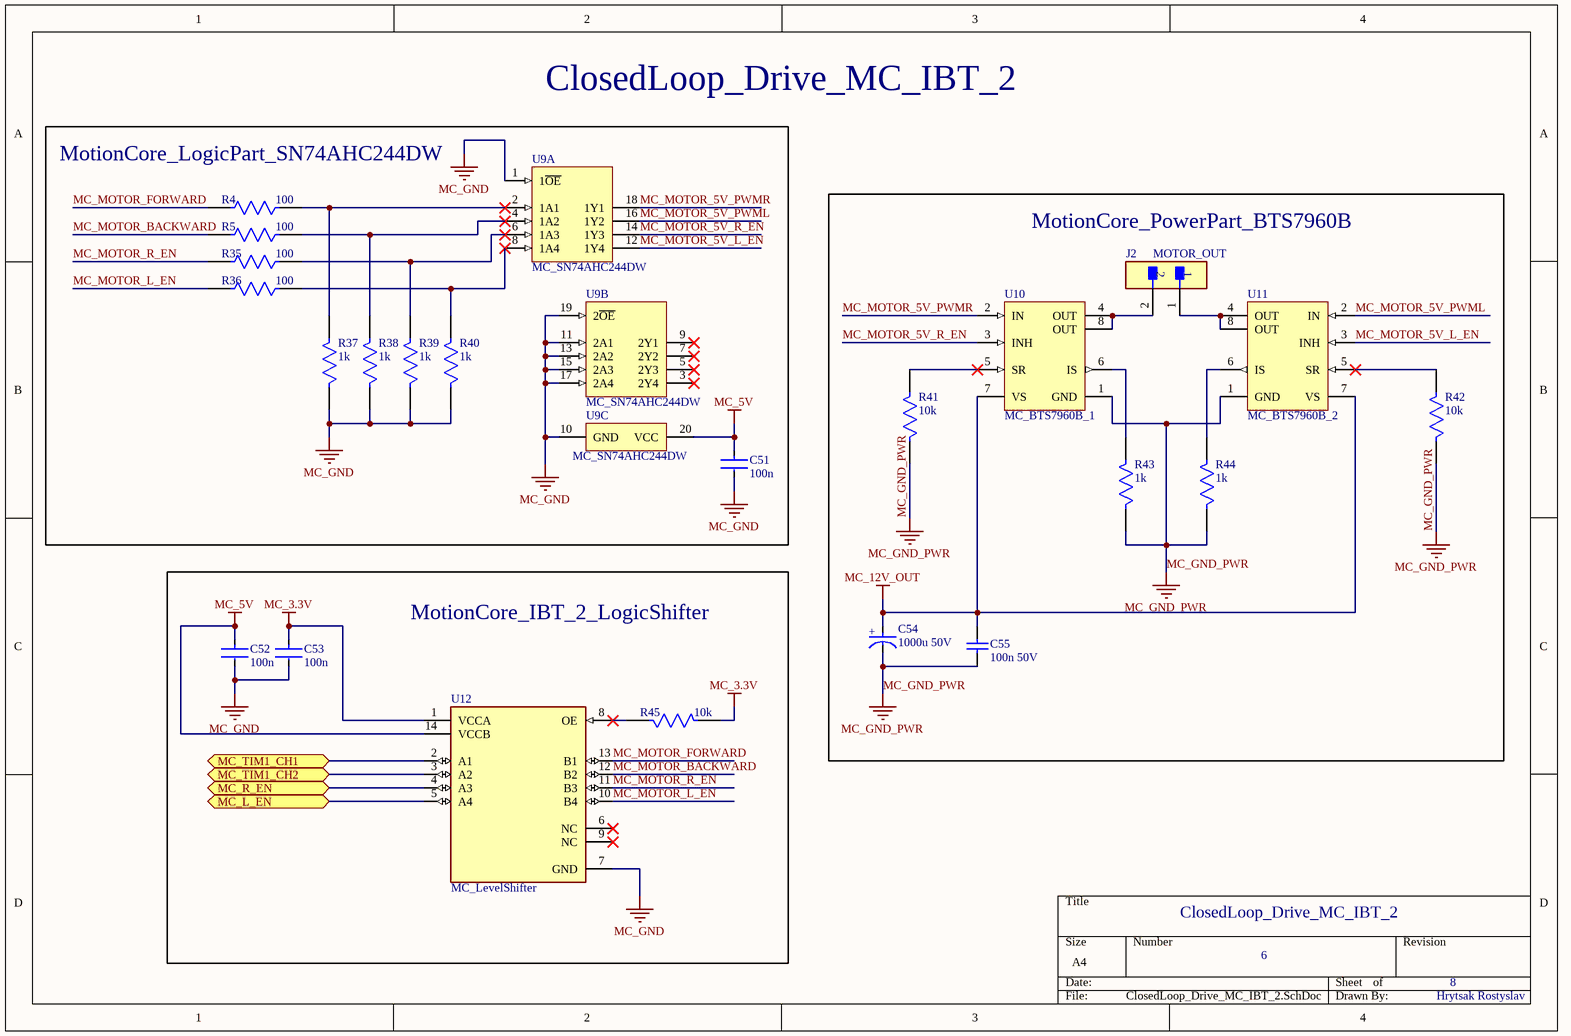
[diagram p4: ClosedLoop_Drive_MC_IBT_2.SchDoc]

### Parts
C51  100n  [FP-0805-L_2_01_0_2-W_1_25-MFG]
C52  100n  [FP-0805-L_2_01_0_2-W_1_25-MFG]
C53  100n  [FP-0805-L_2_01_0_2-W_1_25-MFG]
C54  1000u 50V  [FP-RAD-TH-D_16_0_5-L_25_2-MFG]
C55  100n 50V  [CAPC2013X135X45ML10T25]
J2  MOTOR_OUT  [FP-TSW-102-07-F-S-MFG]
R4  100  [FP-MCU0805-IPC_A]
R5  100  [FP-MCU0805-IPC_A]
R35  100  [FP-MCU0805-IPC_A]
R36  100  [FP-MCU0805-IPC_A]
R37  1k  [FP-MCU0805-IPC_A]
R38  1k  [FP-MCU0805-IPC_A]
R39  1k  [FP-MCU0805-IPC_A]
R40  1k  [FP-MCU0805-IPC_A]
R41  10k  [FP-MCU0805-IPC_A]
R42  10k  [FP-MCU0805-IPC_A]
R43  1k  [FP-MCU0805-IPC_A]
R44  1k  [FP-MCU0805-IPC_A]
R45  10k  [FP-MCU0805-IPC_A]
U9  MC_SN74AHC244DW  [DW0020A_N]  (parts A,B,C of 3)
U10  MC_BTS7960B_1  [INF-P-TO-263-7-6_M]
U11  MC_BTS7960B_2  [INF-P-TO-263-7-6_M]
U12  MC_LevelShifter  [FP-PW0014A-IPC_C]

### Blocks framed on the sheet
MotionCore_LogicPart_SN74AHC244DW: C51 R4 R5 R35-R40 U9
MotionCore_PowerPart_BTS7960B: C54 C55 J2 R41-R44 U10 U11
MotionCore_IBT_2_LogicShifter: C52 C53 R45 U12

### Ports
MC_L_EN (bidir, see ClosedLoop_Drive_MotionCore[3C]), MC_R_EN (bidir, see ClosedLoop_Drive_MotionCore[3C]), MC_TIM1_CH1 (bidir, see ClosedLoop_Drive_MotionCore[1C]), MC_TIM1_CH2 (bidir, see ClosedLoop_Drive_MotionCore[1C])

### Nets
MC_3.3V: C53.1 R45.2 U12.1(VCCA)
MC_5V: C51.1 C52.1 U9.20(VCC) U12.14(VCCB)
MC_12V_OUT: C54.2(A) C55.2 U10.7(VS) U11.7(VS)
MC_GND: C51.2 C52.2 C53.2 R37.1 R38.1 R39.1 R40.1 U9.1(1~{OE}) U9.10(GND) U9.11(2A1) U9.13(2A2) U9.15(2A3) U9.17(2A4) U9.19(2~{OE}) U12.7(GND)
MC_GND_PWR: C54.1(C) C55.1 R41.1 R42.1 R43.1 R44.1 U10.1(GND) U11.1(GND)
MC_MOTOR_5V_L_EN: U9.12(1Y4) U11.3(INH)
MC_MOTOR_5V_PWML: U9.16(1Y2) U11.2(IN)
MC_MOTOR_5V_PWMR: U9.18(1Y1) U10.2(IN)
MC_MOTOR_5V_R_EN: U9.14(1Y3) U10.3(INH)
MC_MOTOR_BACKWARD: R5.2 U12.12(B2)
MC_MOTOR_FORWARD: R4.2 U12.13(B1)
MC_MOTOR_L_EN: R36.2 U12.10(B4)
MC_MOTOR_R_EN: R35.2 U12.11(B3)
NetJ2_1: J2.1 U11.4(OUT) U11.8(OUT)
NetJ2_2: J2.2 U10.4(OUT) U10.8(OUT)
NetR4_1: R4.1 R37.2 U9.2(1A1)
NetR5_1: R5.1 R38.2 U9.4(1A2)
NetR35_1: R35.1 R39.2 U9.6(1A3)
NetR36_1: R36.1 R40.2 U9.8(1A4)
NetR41_2: R41.2 U10.5(SR)
NetR42_2: R42.2 U11.5(SR)
NetR43_2: R43.2 U10.6(IS)
NetR44_2: R44.2 U11.6(IS)
NetR45_1: R45.1 U12.8(OE)
NetU12_2: U12.2(A1) ; port MC_TIM1_CH1
NetU12_3: U12.3(A2) ; port MC_TIM1_CH2
NetU12_4: U12.4(A3) ; port MC_R_EN
NetU12_5: U12.5(A4) ; port MC_L_EN

Not connected (* = marked no-connect by the designer): U9 3(2Y4)* 5(2Y3)* 7(2Y2)* 9(2Y1)*; U12 6(NC)* 9(NC)*

### Notes on the sheet
- ClosedLoop_Drive_MC_IBT_2
- 6
- 8
- Hrytsak Rostyslav
- (in symbol CMP-05427-000625-1) +

### Library data of the parts
C51-C53 = CMP-07738-122049624-1: as C14 on sheet ClosedLoop_Drive_UserInterface; Case/Package: 0805; Height: 1.4mm; Voltage Rating: 100V; Schedule B: 8532240020; NexarPartId: 122049624; RoHS: Compliant; Lifecycle Status: Production; Min Operating Temperature: -55°C; Max Operating Temperature: 125°C
C54 = CMP-05427-000625-1: Aluminum Electrolytic Capacitors (Radial Lead Type) 1000uF ±20% 50V; Polarity: Polar; ESR (Equivalent Series Resistance): 16mR; Ripple Current: 3.32A; Life (Hours): 10000Hour; Lead Diameter: 0.8mm; Dielectric Material: Aluminium; Lead/Base Style: Straight; Capacitance: 1mF; RoHS Compliant: Yes; Mount: Through Hole; Voltage Rating: 50V; Lead Free: Lead Free; Packaging: Bulk; Min Operating Temperature: -40°C; Package Quantity: 100; Max Operating Temperature: 105°C; Radiation Hardening: No; Termination: Radial; Construction: RADIAL; Height: 25mm; Length: 25mm; Tolerance: 20%; Number of Pins: 2; Ripple Current (AC): 3.32A; Diameter: 16mm; Case/Package: Radial; Impedance: 16mR; Height - Seated (Max): 1.063inch; Voltage: 50V; Voltage Rating (DC): 50V; Series: FR; Lead Pitch: 7.5mm
C55 = CMP-2100-03644-1: Chip Capacitor, 0.1 uF, +/- 10%, 50 V, -55 to 125 degC, 0805 (2012 Metric), RoHS, Tape and Reel; Manufacturer: Murata; Capacitance: 100nF; Insulation Resistance: 10GR; Dielectric Material: Ceramic; Dielectric: X7R; Package Description: 2-Pin Surface Mount Device, Body 2 x 1.25 mm; Manufacturer URL: http://www.murata.com/; Case Code (Imperial): 0805; Voltage: 50V; Datasheet URL: http://psearch.en.murata.com/capacitor/product/GRM21BR71H104KA01%23.pdf; Termination: SMD/SMT; Lead Free: LeadFree; Package Quantity: 1; Mount: SurfaceMount; REACH SVHC: Unknown; Thickness: 0.053inch; Height: 1.25mm; Case/Package: 0805; Voltage Rating: 50V; Width: 0.049inch; Case Code (Metric): 2012; Material: Ceramic; Min Operating Temperature: -55degC; RoHSCompliant: true; Datasheet Version: 42675.0; Voltage Rating (DC): 50V; Tolerance: 10%; Package Reference: 0805; Depth: 1.25mm; Length: 2mm; Max Operating Temperature: 125degC; Packaging: TapeandReel; Number of Pins: 2; Radiation Hardening: No
J2 = CMP-02766-001458-1: as J5 on sheet ClosedLoop_Drive_PowerSupply; Orientation: Straight; Depth: 2.54mm; Series: TSW; Package Quantity: 1; Min Operating Temperature: -55°C; Max Operating Temperature: 125°C; Contact Type: Male Pin; Contact Shape: Square; Color: Black; Housing Color: Black; Connector Type: Header; Fastening Type: Pull; Radiation Hardening: No; Pitch: 2.54mm; Housing Material: Polyester; Mount: Through Hole; Number of Positions: 2; Number of Rows: 1; Contact Material: Bronze; Insulation Color: Black; Contact Finish - Mating: GOLD; Termination: Solder; Insulation Material: PBT; Length: 5.08mm; Flammability Rating: UL94 V-0; Contact Mating Length: 0.23inch; REACH SVHC: No SVHC; Contact Plating: Gold; RoHS Compliant: Yes; Packaging: Bulk
R4 R5 R35-R45 = CMP-02407-001153-1: as R7 on sheet ClosedLoop_Drive_UserInterface; Case Code (Imperial): 0805; Features: Automotive AEC-Q200; Case Code (Metric): 2012; Weight: 0.000162oz; Width: 0.049inch; Packaging: Tape and Reel; Composition: Thin Film; Height: 0.024inch; Termination: SMD/SMT; Number of Terminations: 2; Min Operating Temperature: -55°C; Length: 0.079inch; Package Quantity: 5000; Max Operating Temperature: 175°C; Case/Package: 0805; Max Power Dissipation: 200mW
U9 = CMP-0440-00700-3: Octal Buffers/Drivers With 3-State Outputs, DW0020A, TUBE; Manufacturer: Texas Instruments; tpd @ Nom Voltage(Max)(ns): 11,8.5; Output Type: CMOS; F @ Nom Voltage(Max)(Mhz): 110; VCC(Max)(V): 5.5; Voltage(Nom)(V): 3.3,5; VCC(Min)(V): 2; Bits(#): 8; Rating: Catalog; ICC @ Nom Voltage(Max)(mA): 0.04; DatasheetVersion: SCLS226K; PackageReference: DW0020A; Operating Temperature Range(C): -40 to 85; Input Type: CMOS; Code_JEDEC: MS-013; Generic Part Number: SN74AHC244; PackageVersion: http://www.ti.com/lit/ml/mpds173a/mpds173a.pdf
U10 U11 = CMP-1114-00025-1: High Current PN Half Bridge NovalithIC, -40 to 150 degC, P-TO-263-7-6; Manufacturer: Infineon; Iq (typ): 7 uA; Green: FALSE; ComponentLink1Description: Manufacturer URL; Halogen-free: FALSE; PackageDescription: 7-Pin Plastic Transistor Single Outline Package, 9.9 x 9.2 mm Body, 1.27 mm Pitch; ComponentLink2Description: Datasheet; ComponentLink3Description: Package Specification; ComponentLink1URL: http://www.infineon.com/; ComponentLink2URL: http://www.infineon.com/dgdl/BTS7960_Datasheet.pdf?folderId=db3a304412b407950112b408e8c90004&fileId=db3a304412b407950112b43945006d5d&location=en.Products.Automotive_ICs.Motor_Drivers__Automotive_.Integrated_High_Current_Motor_Drivers__NovalithIC____Trilith; ComponentLink3URL: http://www.infineon.com/dgdl/BTS7970B_Datasheet.pdf?folderId=db3a304412b407950112b408e8c90004&fileId=db3a304412b407950112b43949b36d61&sId=db3a30433d68e984013d7db637dc5e6a; PackageReference: P-TO-263-7-6; PackageVersion: May-06; Mounting Technology: Surface Mount; RevisionNote: Re-Activated Devices; PartNumber: BTS7960B; DatasheetVersion: Rev. 1.1
U12 = CMP-04899-000064-1: IC TRNSLTR BIDIRECTIONAL 14TSSOP; Min Supply Voltage: 1.65V; Quiescent Current: 14.4uA; Data Rate: 24Mbps; Logic Function: Translator; Number of Circuits: 1; Number of Bits: 4; Low Level Output Current: 1mA; Max Supply Voltage: 5.5V; High Level Output Current: -20uA; Operating Supply Current: 25uA; Propagation Delay: 4.6ns; Contact Plating: Gold; Package Quantity: 2000; Number of Pins: 14; Lead Free: Lead Free; Weight: 0.004949oz; Min Operating Temperature: -40°C; Number of Channels: 4; Packaging: Tape and Reel; Mount: Surface Mount; Max Operating Temperature: 125°C; Case/Package: TSSOP; Channel Type: Bidirectional; RoHS Compliant: Yes; Radiation Hardening: No

## Sheet ClosedLoop_Drive_CAN_Transceivers.SchDoc
size A4; SheetNumber: 7; SheetTotal: 8
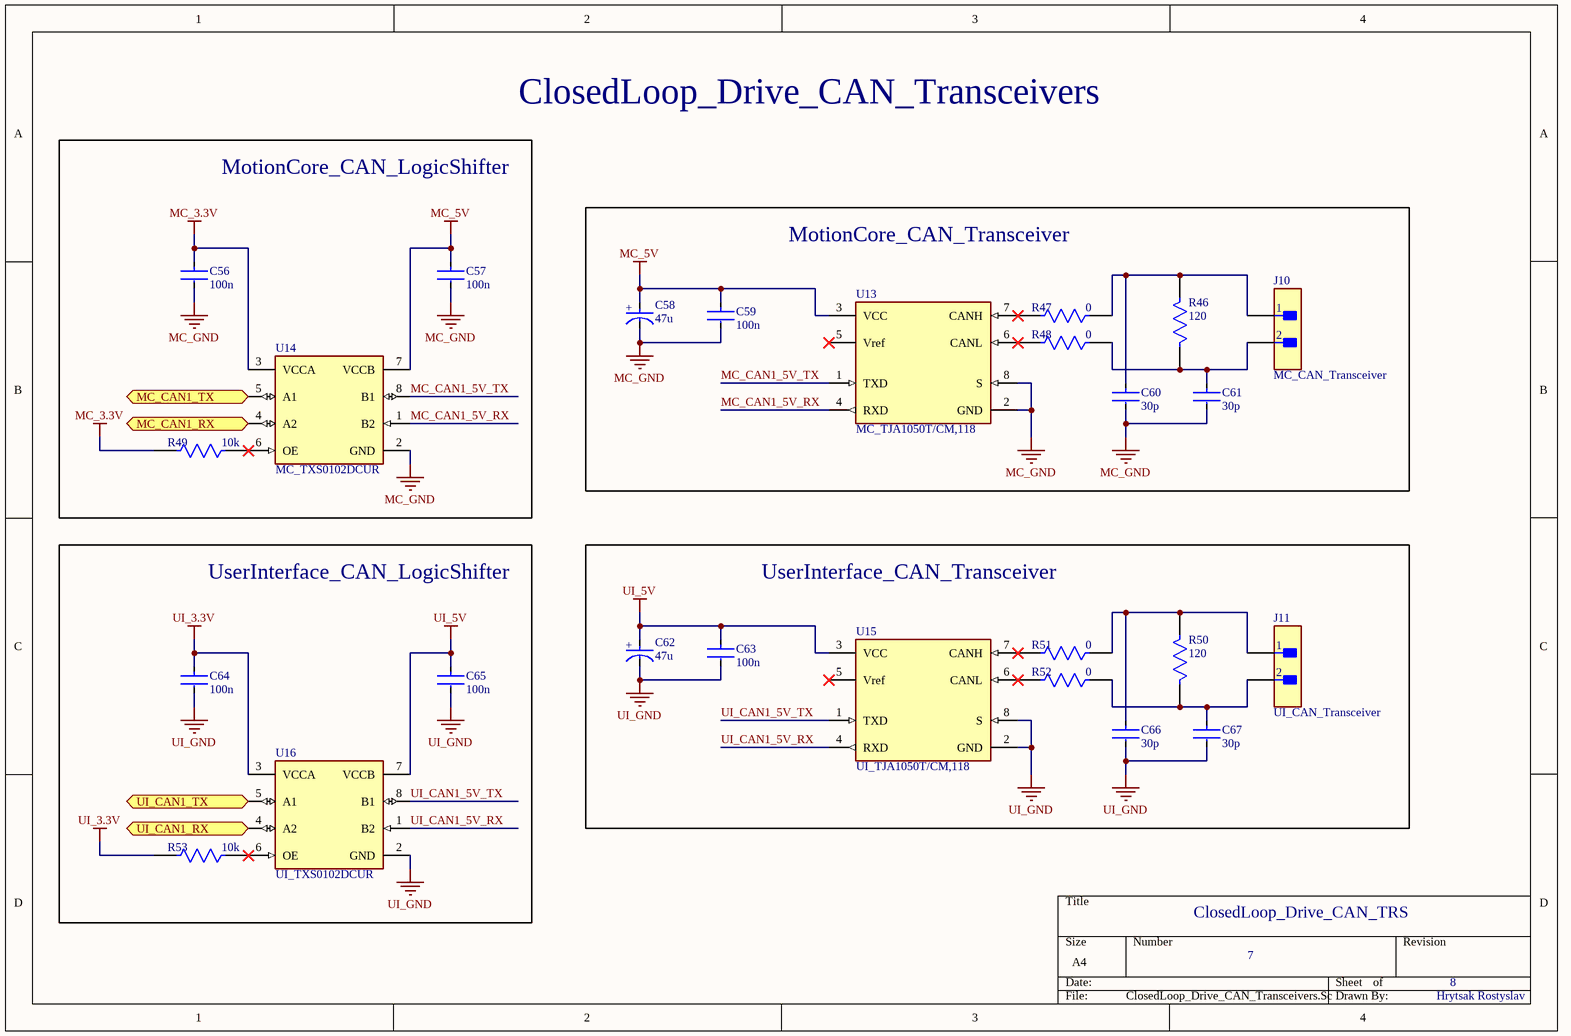
[diagram p5: ClosedLoop_Drive_CAN_Transceivers.SchDoc]

### Parts
C56  100n  [FP-0805-L_2_01_0_2-W_1_25-MFG]
C57  100n  [FP-0805-L_2_01_0_2-W_1_25-MFG]
C58  47u  [FP-RAD-TH-D_6_3_0_5-L_11-MFG]
C59  100n  [FP-0805-L_2_01_0_2-W_1_25-MFG]
C60  30p  [FP-0805-L_2_01_0_2-W_1_25-MFG]
C61  30p  [FP-0805-L_2_01_0_2-W_1_25-MFG]
C62  47u  [FP-RAD-TH-D_6_3_0_5-L_11-MFG]
C63  100n  [FP-0805-L_2_01_0_2-W_1_25-MFG]
C64  100n  [FP-0805-L_2_01_0_2-W_1_25-MFG]
C65  100n  [FP-0805-L_2_01_0_2-W_1_25-MFG]
C66  30p  [FP-0805-L_2_01_0_2-W_1_25-MFG]
C67  30p  [FP-0805-L_2_01_0_2-W_1_25-MFG]
J10  MC_CAN_Transceiver  [FP-TSW-102-07-F-S-MFG]
J11  UI_CAN_Transceiver  [FP-TSW-102-07-F-S-MFG]
R46  120  [FP-MCU0805-IPC_A]
R47  0  [FP-MCU0805-IPC_A]
R48  0  [FP-MCU0805-IPC_A]
R49  10k  [FP-MCU0805-IPC_A]
R50  120  [FP-MCU0805-IPC_A]
R51  0  [FP-MCU0805-IPC_A]
R52  0  [FP-MCU0805-IPC_A]
R53  10k  [FP-MCU0805-IPC_A]
U13  MC_TJA1050T/CM,118  [FP-SOT96-1-IPC_A]
U14  MC_TXS0102DCUR  [FP-DCU0008A-MFG]
U15  UI_TJA1050T/CM,118  [FP-SOT96-1-IPC_A]
U16  UI_TXS0102DCUR  [FP-DCU0008A-MFG]

### Blocks framed on the sheet
MotionCore_CAN_LogicShifter: C56 C57 R49 U14
MotionCore_CAN_Transceiver: C58-C61 J10 R46-R48 U13
UserInterface_CAN_LogicShifter: C64 C65 R53 U16
UserInterface_CAN_Transceiver: C62 C63 C66 C67 J11 R50-R52 U15

### Ports
MC_CAN1_RX (bidir, see ClosedLoop_Drive_MotionCore[1D]), MC_CAN1_TX (bidir, see ClosedLoop_Drive_MotionCore[1D]), UI_CAN1_RX (bidir, see ClosedLoop_Drive_UserInterface[3C]), UI_CAN1_TX (bidir, see ClosedLoop_Drive_UserInterface[3C])

### Nets
MC_3.3V: C56.1 R49.2 U14.3(VCCA)
MC_5V: C57.1 C58.2(A) C59.1 U13.3(VCC) U14.7(VCCB)
MC_GND: C56.2 C57.2 C58.1(C) C59.2 C60.2 C61.2 U13.2(GND) U13.8(S) U14.2(GND)
UI_3.3V: C64.1 R53.2 U16.3(VCCA)
UI_5V: C62.2(A) C63.1 C65.1 U15.3(VCC) U16.7(VCCB)
UI_GND: C62.1(C) C63.2 C64.2 C65.2 C66.2 C67.2 U15.2(GND) U15.8(S) U16.2(GND)
MC_CAN1_5V_RX: U13.4(RXD) U14.1(B2)
MC_CAN1_5V_TX: U13.1(TXD) U14.8(B1)
UI_CAN1_5V_RX: U15.4(RXD) U16.1(B2)
UI_CAN1_5V_TX: U15.1(TXD) U16.8(B1)
NetC60_1: C60.1 J10.1 R46.2 R47.1
NetC61_1: C61.1 J10.2 R46.1 R48.1
NetC66_1: C66.1 J11.1 R50.2 R51.1
NetC67_1: C67.1 J11.2 R50.1 R52.1
NetR47_2: R47.2 U13.7(CANH)
NetR48_2: R48.2 U13.6(CANL)
NetR49_1: R49.1 U14.6(OE)
NetR51_2: R51.2 U15.7(CANH)
NetR52_2: R52.2 U15.6(CANL)
NetR53_1: R53.1 U16.6(OE)
NetU2_45: U16.4(A2) ; port UI_CAN1_RX
NetU2_46: U16.5(A1) ; port UI_CAN1_TX
NetU14_4: U14.4(A2) ; port MC_CAN1_RX
NetU14_5: U14.5(A1) ; port MC_CAN1_TX

Not connected (* = marked no-connect by the designer): U13 5(Vref)*; U15 5(Vref)*

### Notes on the sheet
- ClosedLoop_Drive_CAN_Transceivers
- ClosedLoop_Drive_CAN_TRS
- 7
- 8
- Hrytsak Rostyslav
- (in symbol CMP-05427-000141-1) +

### Library data of the parts
C56 C57 C59-C61 C63-C67 = CMP-07738-122049624-1: as C14 on sheet ClosedLoop_Drive_UserInterface; Case/Package: 0805; Height: 1.4mm; Voltage Rating: 100V; Schedule B: 8532240020; NexarPartId: 122049624; RoHS: Compliant; Lifecycle Status: Production; Min Operating Temperature: -55°C; Max Operating Temperature: 125°C
C58 C62 = CMP-05427-000141-1: as C36 on sheet ClosedLoop_Drive_PowerSupply; Construction: RADIAL; Radiation Hardening: No; Packaging: Ammo Pack; Termination: Radial; Mount: Through Hole; Lead Pitch: 2.5mm; Tolerance: 20%; Height - Seated (Max): 0.48inch; Height: 11.2mm; Max Operating Temperature: 105°C; Length: 11.2mm; Diameter: 6.3mm; RoHS Compliant: Yes; Voltage Rating: 25V; Min Operating Temperature: -55°C; Package Quantity: 2000; Capacitance: 100uF; Width: 6.3mm; Voltage Rating (DC): 25V; Series: NHG; Contact Plating: Tin; Case/Package: Radial
J10 J11 = CMP-02766-001458-1: as J5 on sheet ClosedLoop_Drive_PowerSupply; Orientation: Straight; Depth: 2.54mm; Series: TSW; Package Quantity: 1; Min Operating Temperature: -55°C; Max Operating Temperature: 125°C; Contact Type: Male Pin; Contact Shape: Square; Color: Black; Housing Color: Black; Connector Type: Header; Fastening Type: Pull; Radiation Hardening: No; Pitch: 2.54mm; Housing Material: Polyester; Mount: Through Hole; Number of Positions: 2; Number of Rows: 1; Contact Material: Bronze; Insulation Color: Black; Contact Finish - Mating: GOLD; Termination: Solder; Insulation Material: PBT; Length: 5.08mm; Flammability Rating: UL94 V-0; Contact Mating Length: 0.23inch; REACH SVHC: No SVHC; Contact Plating: Gold; RoHS Compliant: Yes; Packaging: Bulk
R46-R53 = CMP-02407-001153-1: as R7 on sheet ClosedLoop_Drive_UserInterface; Case Code (Imperial): 0805; Features: Automotive AEC-Q200; Case Code (Metric): 2012; Weight: 0.000162oz; Width: 0.049inch; Packaging: Tape and Reel; Composition: Thin Film; Height: 0.024inch; Termination: SMD/SMT; Number of Terminations: 2; Min Operating Temperature: -55°C; Length: 0.079inch; Package Quantity: 5000; Max Operating Temperature: 175°C; Case/Package: 0805; Max Power Dissipation: 200mW
U13 U15 = CMP-2000-04923-2: IC TRANSCEIVER HALF 1/1 8SO; Simplex/Duplex: Half Duplex; Max Supply Current: 10mA; Number of Receive Buffers: 1; Min Supply Voltage: 4.75V; Max Supply Voltage: 5.25V; Interface: CAN; Data Rate: 1Mbps; Receiver Hysteresis: 70mV; Number of Transmit Buffers: 1; Min Operating Temperature: -40°C; Case/Package: SO; REACH SVHC: No SVHC; Max Operating Temperature: 150°C; Number of Pins: 8; Lead Free: Lead Free; Number of Transceivers: 1; Packaging: Tape and Reel; Mount: Surface Mount; Radiation Hardening: No; Nominal Supply Current: 10mA; Package Quantity: 2500; Contact Plating: Gold
U14 U16 = CMP-0859-00001-2: IC TRNSLTR BIDIRECTIONAL US8; Manufacturer: Texas Instruments; Number Of Circuits: 1; Number Of Inputs: 2; Data Rate: 24Mbits/s; Max Junction Temp: +150°C; V A Min: 1.65V; Standoff Height: 0mm; Logic Function Desc: Bidirectional Voltage-Level Translator; Max Supply Voltage: 5.5V; V A Max: 3.6V; Nominal Supply Current: 1-14.4uA; V B Min: 2.3V; Temperature: -40°C to +85°C; Temperature Range Low: -40°C; Height: 0.9mm; Device Class L1: Integrated Circuits (ICs); RoHS: TRUE; Min Supply Voltage: 1.65V; Digikey Description: IC TRNSLTR BIDIRECTIONAL US8; ComponentLink2Description: Datasheet; Octopart: https://octopart.com/txs0102dcur-texas+instruments-5414308; Temperature Range High: +85°C; Device Class L2: Logic ICs; Category: IC; Ambient Temperature Range High: +85°C; Automotive: No; Manufacturer Part Number: TXS0102DCUR; Device Class L3: Voltage Level Shifters; Number Of Outputs: 2; Ambient Temperature Range Low: -40°C; Lead Free: Yes; ComponentLink2URL: http://www.ti.com/lit/ds/symlink/txs0102.pdf; V B Max: 5.5V; Package: DCU0008A; Mouser Description: Translation - Voltage Levels 2-Bit Bi-Directional Voltage-Level-Trans

## Sheet ClosedLoop_Drive_UI_Display.SchDoc
size A4; SheetNumber: 8; SheetTotal: 8
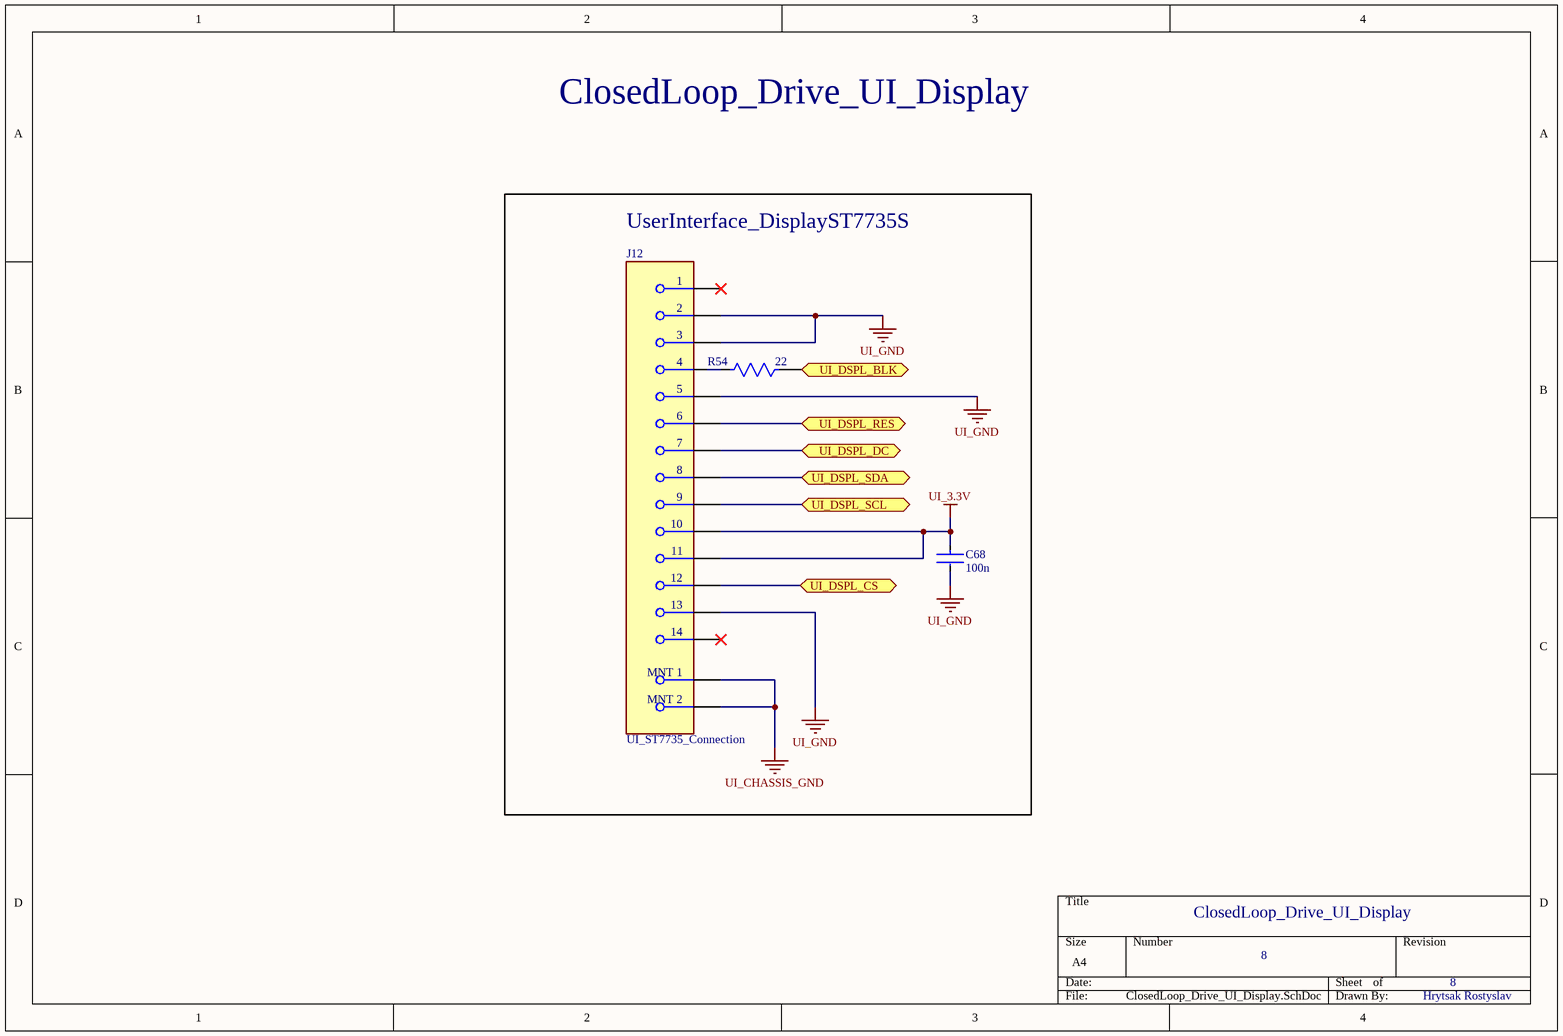
[diagram p6: ClosedLoop_Drive_UI_Display.SchDoc]

### Parts
C68  100n  [FP-0805-L_2_01_0_2-W_1_25-MFG]
J12  UI_ST7735_Connection  [FP-TF31-14S-0_5SH_800-MFG]
R54  22  [FP-MCU0805-IPC_A]

### Blocks framed on the sheet
UserInterface_DisplayST7735S: C68 J12 R54

### Ports
UI_DSPL_BLK (bidir, see ClosedLoop_Drive_UserInterface[3C]), UI_DSPL_CS (bidir, see ClosedLoop_Drive_UserInterface[1C]), UI_DSPL_DC (bidir, see ClosedLoop_Drive_UserInterface[3C]), UI_DSPL_RES (bidir, see ClosedLoop_Drive_UserInterface[3C]), UI_DSPL_SCL (bidir, see ClosedLoop_Drive_UserInterface[1C]), UI_DSPL_SDA (bidir, see ClosedLoop_Drive_UserInterface[1C])

### Nets
UI_3.3V: C68.1 J12.10 J12.11
UI_CHASSIS_GND: J12.15(MNT_1) J12.16(MNT_2)
UI_GND: C68.2 J12.2 J12.3 J12.5 J12.13
NetJ12_4: J12.4 R54.2
NetJ12_6: J12.6 ; port UI_DSPL_RES
NetJ12_7: J12.7 ; port UI_DSPL_DC
NetJ12_8: J12.8 ; port UI_DSPL_SDA
NetJ12_9: J12.9 ; port UI_DSPL_SCL
NetJ12_12: J12.12 ; port UI_DSPL_CS
NetR54_1: R54.1 ; port UI_DSPL_BLK

Not connected (* = marked no-connect by the designer): J12 1* 14*

### Notes on the sheet
- ClosedLoop_Drive_UI_Display
- 8
- Hrytsak Rostyslav

### Library data of the parts
C68 = CMP-07738-122049624-1: as C14 on sheet ClosedLoop_Drive_UserInterface; Case/Package: 0805; Height: 1.4mm; Voltage Rating: 100V; Schedule B: 8532240020; NexarPartId: 122049624; RoHS: Compliant; Lifecycle Status: Production; Min Operating Temperature: -55°C; Max Operating Temperature: 125°C
J12 = CMP-11609-000035-1: CONN FFC 14POS 0.50MM SMD; RoHS Compliant: Yes
R54 = CMP-02407-001153-1: as R7 on sheet ClosedLoop_Drive_UserInterface; Case Code (Imperial): 0805; Features: Automotive AEC-Q200; Case Code (Metric): 2012; Weight: 0.000162oz; Width: 0.049inch; Packaging: Tape and Reel; Composition: Thin Film; Height: 0.024inch; Termination: SMD/SMT; Number of Terminations: 2; Min Operating Temperature: -55°C; Length: 0.079inch; Package Quantity: 5000; Max Operating Temperature: 175°C; Case/Package: 0805; Max Power Dissipation: 200mW

## Nets that join several sheets
MC_3.3V: ClosedLoop_Drive_PowerSupply (C37.2 U4.2 U4.4), ClosedLoop_Drive_MC_Sensors (7 pins), ClosedLoop_Drive_MC_MicroSD_Card (9 pins), ClosedLoop_Drive_MC_IBT_2 (C53.1 R45.2 U12.1), ClosedLoop_Drive_CAN_Transceivers (C56.1 R49.2 U14.3)
MC_5V: ClosedLoop_Drive_PowerSupply (14 pins), ClosedLoop_Drive_MC_IBT_2 (C51.1 C52.1 U9.20 U12.14), ClosedLoop_Drive_CAN_Transceivers (5 pins)
MC_12V_IN: ClosedLoop_Drive_PowerSupply (J5.1), ClosedLoop_Drive_MC_Sensors (R26.1 U8.1)
MC_12V_OUT: ClosedLoop_Drive_MC_Sensors (R26.2 U8.2), ClosedLoop_Drive_MC_IBT_2 (C54.2 C55.2 U10.7 U11.7)
MC_CHASSIS_GND: ClosedLoop_Drive_PowerSupply (6 pins), ClosedLoop_Drive_MC_MicroSD_Card (J9.11 J9.12 J9.13 J9.14)
MC_GND: ClosedLoop_Drive_PowerSupply (19 pins), ClosedLoop_Drive_MC_Sensors (6 pins), ClosedLoop_Drive_MC_MicroSD_Card (C49.1 C50.2 J9.6 J9.9), ClosedLoop_Drive_MC_IBT_2 (15 pins), ClosedLoop_Drive_CAN_Transceivers (9 pins)
MC_GND_PWR: ClosedLoop_Drive_PowerSupply (C27.1 J5.2 R14.2 R55.2), ClosedLoop_Drive_MC_IBT_2 (8 pins)
UI_3.3V: ClosedLoop_Drive_UserInterface (17 pins), ClosedLoop_Drive_PowerSupply (C39.2 R22.2 U5.2 U5.4), ClosedLoop_Drive_CAN_Transceivers (C64.1 R53.2 U16.3), ClosedLoop_Drive_UI_Display (C68.1 J12.10 J12.11)
UI_5V: ClosedLoop_Drive_PowerSupply (14 pins), ClosedLoop_Drive_CAN_Transceivers (5 pins)
UI_CHASSIS_GND: ClosedLoop_Drive_UserInterface (R10.4 R10.5), ClosedLoop_Drive_PowerSupply (6 pins), ClosedLoop_Drive_UI_Display (J12.15 J12.16)
UI_GND: ClosedLoop_Drive_UserInterface (24 pins), ClosedLoop_Drive_PowerSupply (20 pins), ClosedLoop_Drive_CAN_Transceivers (9 pins), ClosedLoop_Drive_UI_Display (5 pins)
NetJ12_6: ClosedLoop_Drive_UserInterface (U2.42), ClosedLoop_Drive_UI_Display (J12.6)
NetJ12_7: ClosedLoop_Drive_UserInterface (U2.43), ClosedLoop_Drive_UI_Display (J12.7)
NetJ12_8: ClosedLoop_Drive_UserInterface (U2.17), ClosedLoop_Drive_UI_Display (J12.8)
NetJ12_9: ClosedLoop_Drive_UserInterface (U2.15), ClosedLoop_Drive_UI_Display (J12.9)
NetJ12_12: ClosedLoop_Drive_UserInterface (U2.31), ClosedLoop_Drive_UI_Display (J12.12)
NetR54_1: ClosedLoop_Drive_UserInterface (U2.22), ClosedLoop_Drive_UI_Display (R54.1)
NetU2_45: ClosedLoop_Drive_UserInterface (U2.45), ClosedLoop_Drive_CAN_Transceivers (U16.4)
NetU2_46: ClosedLoop_Drive_UserInterface (U2.46), ClosedLoop_Drive_CAN_Transceivers (U16.5)
UI_USB_N: ClosedLoop_Drive_UserInterface (U2.32), ClosedLoop_Drive_PowerSupply (R20.2)
UI_USB_P: ClosedLoop_Drive_UserInterface (U2.33), ClosedLoop_Drive_PowerSupply (R21.2)